# Altium schematic sheet IF_Connectors.SchDoc
size A4; SheetNumber: 23; SheetTotal: 26
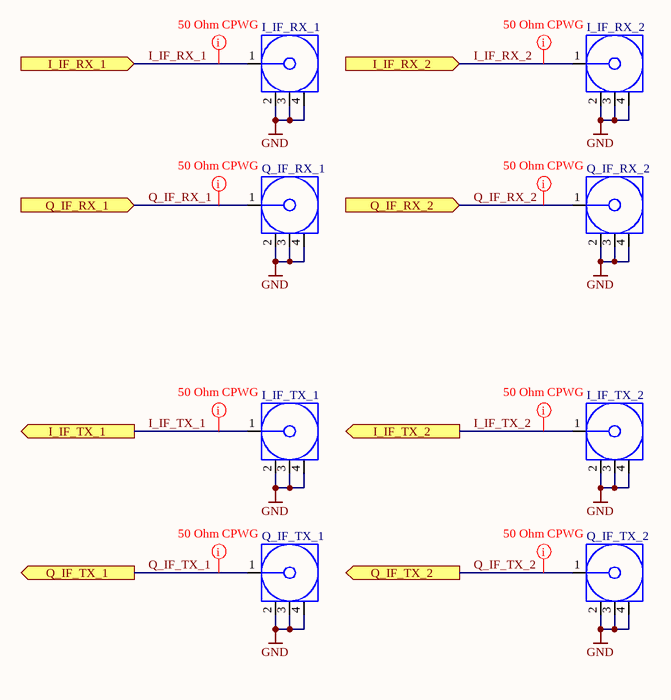
[diagram p0: IF_Connectors.SchDoc]

## Parts
I_IF_RX_1  60312862112552  [60312862112552]  (value not drawn)
I_IF_RX_2  60312862112552  [60312862112552]  (value not drawn)
I_IF_TX_1  60312862112552  [60312862112552]  (value not drawn)
I_IF_TX_2  60312862112552  [60312862112552]  (value not drawn)
Q_IF_RX_1  60312862112552  [60312862112552]  (value not drawn)
Q_IF_RX_2  60312862112552  [60312862112552]  (value not drawn)
Q_IF_TX_1  60312862112552  [60312862112552]  (value not drawn)
Q_IF_TX_2  60312862112552  [60312862112552]  (value not drawn)

## Ports
I_IF_RX_1 (in, see Top_Level[7B], RX_RUBVERANO[7B]), I_IF_RX_2 (in, see Top_Level[7B], RX_RUBVERANO[7B]), I_IF_TX_1 (out, see Top_Level[7B], TX_RUBVERANO[7B]), I_IF_TX_2 (out, see Top_Level[7B], TX_RUBVERANO[7B]), Q_IF_RX_1 (in, see Top_Level[7B], RX_RUBVERANO[7A]), Q_IF_RX_2 (in, see Top_Level[7C], RX_RUBVERANO[7B]), Q_IF_TX_1 (out, see Top_Level[7B], TX_RUBVERANO[7C]), Q_IF_TX_2 (out, see Top_Level[7B], TX_RUBVERANO[7B])

## Nets
GND: I_IF_RX_1.2(GND) I_IF_RX_1.3(GND) I_IF_RX_1.4(GND) I_IF_RX_2.2(GND) I_IF_RX_2.3(GND) I_IF_RX_2.4(GND) I_IF_TX_1.2(GND) I_IF_TX_1.3(GND) I_IF_TX_1.4(GND) I_IF_TX_2.2(GND) I_IF_TX_2.3(GND) I_IF_TX_2.4(GND) Q_IF_RX_1.2(GND) Q_IF_RX_1.3(GND) Q_IF_RX_1.4(GND) Q_IF_RX_2.2(GND) Q_IF_RX_2.3(GND) Q_IF_RX_2.4(GND) Q_IF_TX_1.2(GND) Q_IF_TX_1.3(GND) Q_IF_TX_1.4(GND) Q_IF_TX_2.2(GND) Q_IF_TX_2.3(GND) Q_IF_TX_2.4(GND)
I_IF_RX_1: I_IF_RX_1.1(Signal) ; port I_IF_RX_1
I_IF_RX_2: I_IF_RX_2.1(Signal) ; port I_IF_RX_2
I_IF_TX_1: I_IF_TX_1.1(Signal) ; port I_IF_TX_1
I_IF_TX_2: I_IF_TX_2.1(Signal) ; port I_IF_TX_2
Q_IF_RX_1: Q_IF_RX_1.1(Signal) ; port Q_IF_RX_1
Q_IF_RX_2: Q_IF_RX_2.1(Signal) ; port Q_IF_RX_2
Q_IF_TX_1: Q_IF_TX_1.1(Signal) ; port Q_IF_TX_1
Q_IF_TX_2: Q_IF_TX_2.1(Signal) ; port Q_IF_TX_2

## Layout directives
net class 50Ohm_CPWG: I_IF_RX_1, I_IF_RX_2, I_IF_TX_1, I_IF_TX_2, Q_IF_RX_1, Q_IF_RX_2, Q_IF_TX_1, Q_IF_TX_2

## Library data of the parts
I_IF_RX_1 I_IF_RX_2 I_IF_TX_1 I_IF_TX_2 Q_IF_RX_1 Q_IF_RX_2 Q_IF_TX_1 Q_IF_TX_2 = X000012: WR-SMA Connector, PCB Solderless, DC~18GHz, 50Ohm; Manufacturer: Würth; Center Contact Diameter: 0.25mm; Connector Type: SMA; Gender: Jack; Interface Type: MIL-STD-348; Manufacturer Part Number: 60312862112552; Category: Coaxial Connectors; Match Code: WR-SMA; ComponentLink1Description: Datasheet; ComponentLink1URL: https://www.we-online.com/components/products/datasheet/60312862112552.pdf; ComponentLink2Description: Datasheet Link; ComponentLink2URL: https://www.we-online.com/redexpert/spec/60312862112552?ad; Mount: Screw; Operating Temperature Max: 165°C; Operating Temperature Min: -65°C; Packaging: Tray; Frequency Range: DC~18GHz; Impedance: 50Ohm; Orientation: Right Angle; ID: X000012; Type: SMA Solderless Würth; Part Value: 60312862112552